# Altium schematic sheet kardio.SchDoc
size A3
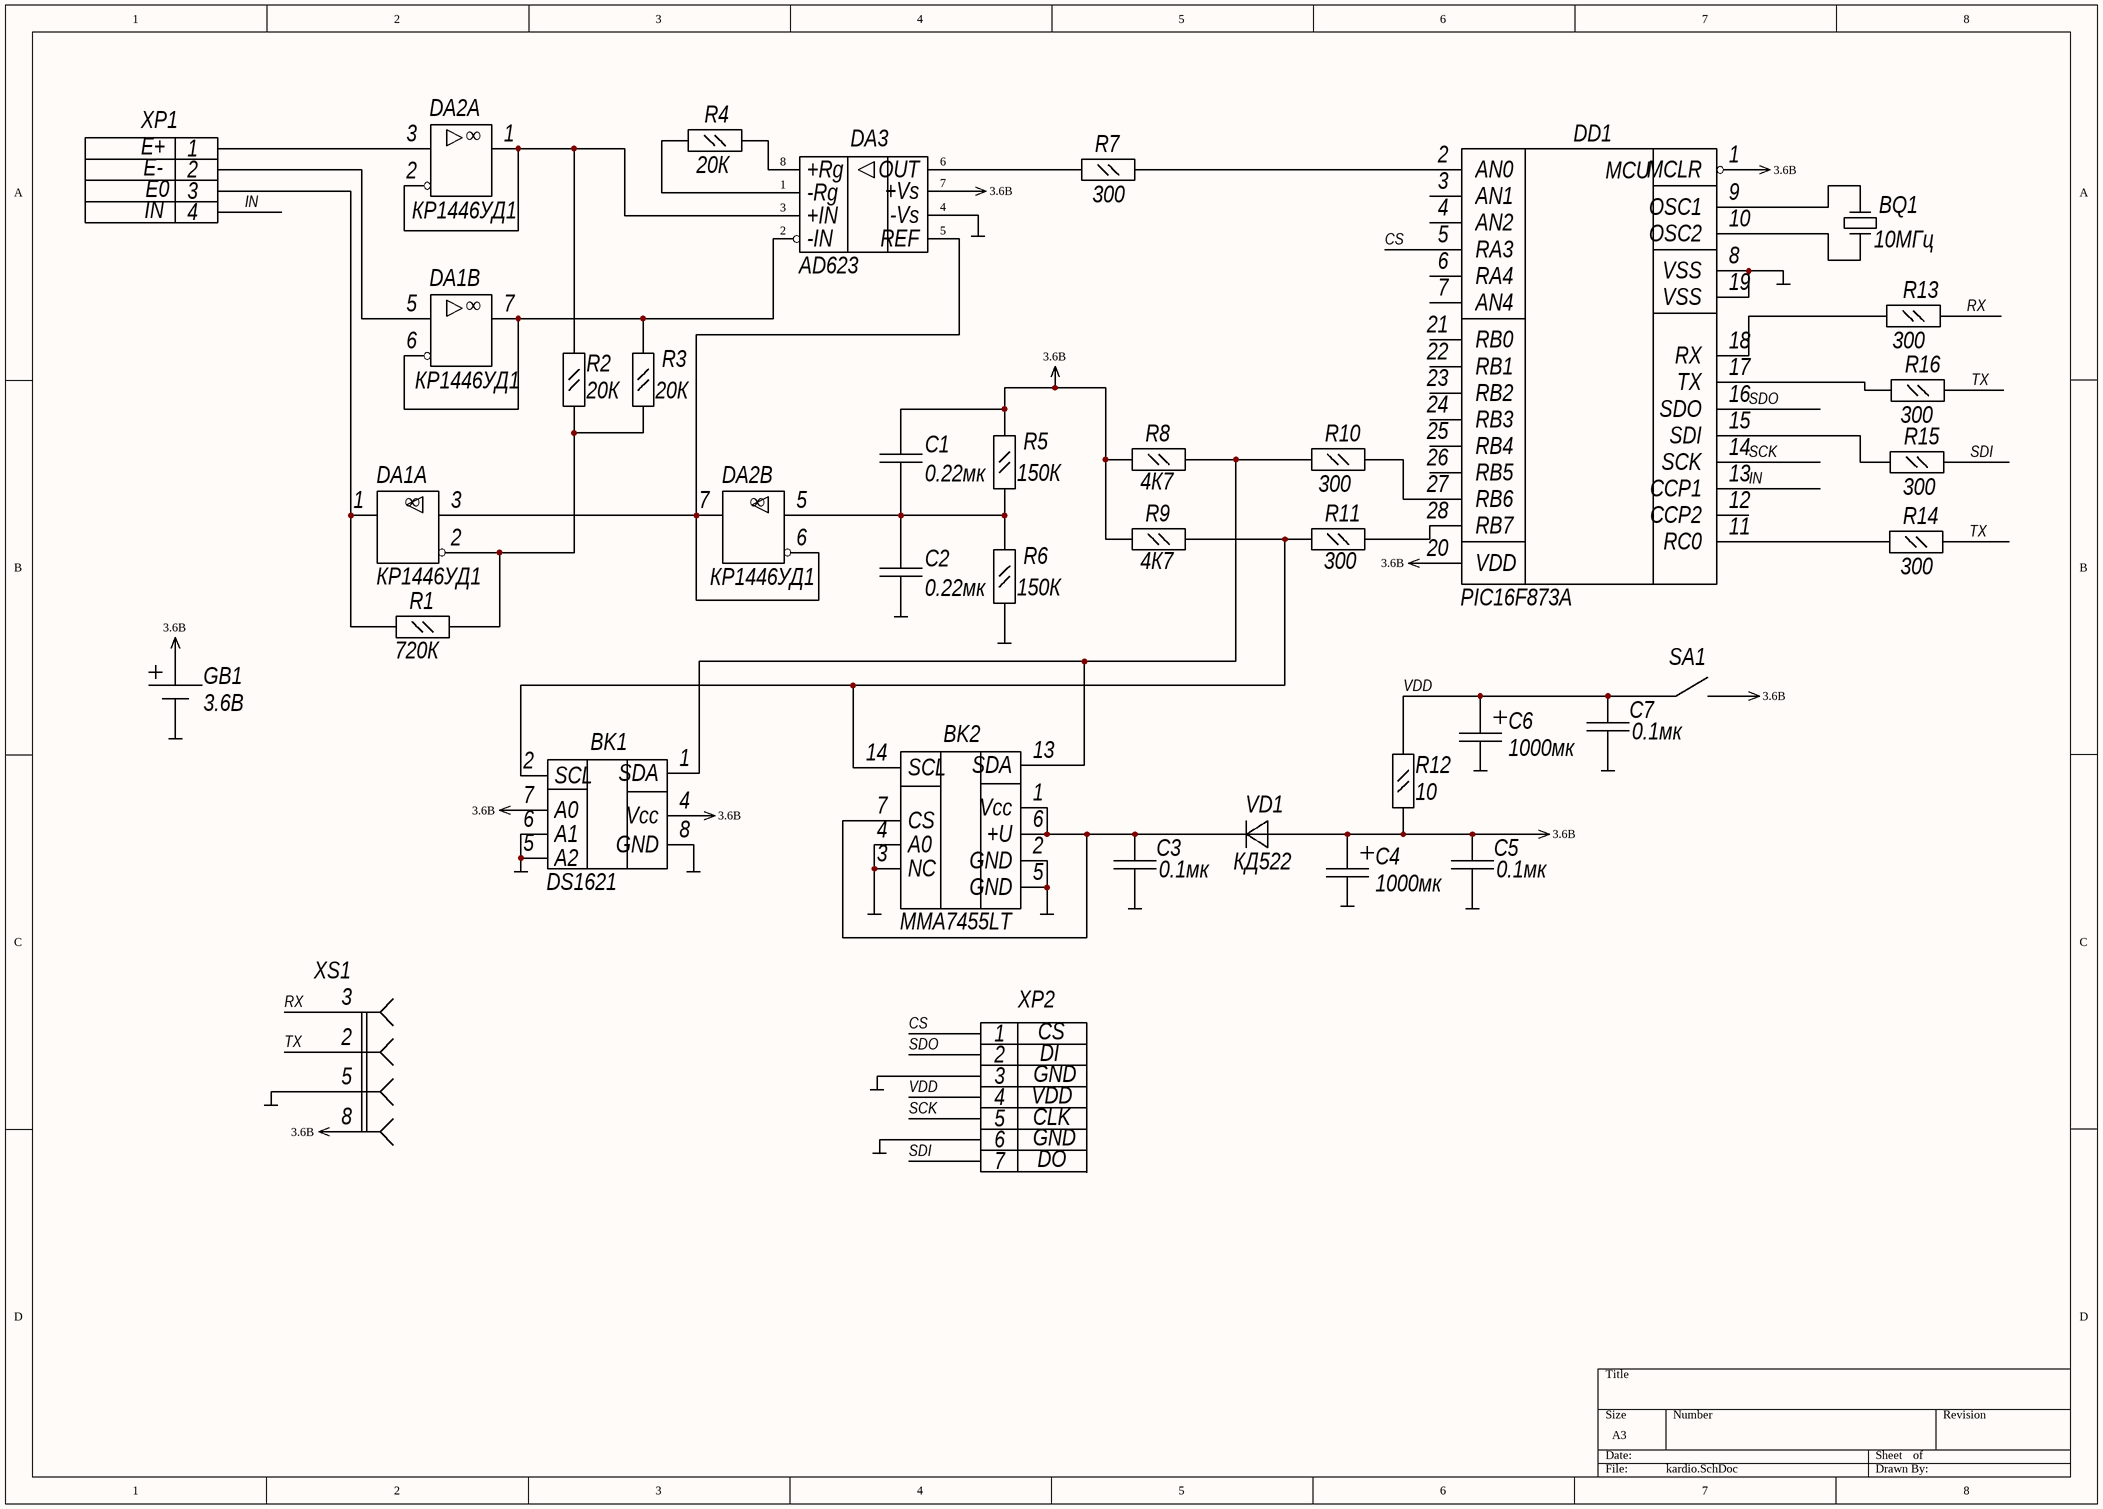
[diagram p0: kardio.SchDoc]

## Parts
BK1  DS1621  [SOIC-8CM]
BK2  MMA7455LT  [SOJ80P300X0-12M]
BQ1  10МГц  [HC49S]
C1  0.22мк  [C0805]
C2  0.22мк  [C0805]
C3  0.1мк  [C0805]
C4  1000мк  [LZ 12x26 1000 мкФ x 25 В]
C5  0.1мк  [C0805]
C6  1000мк  [LZ 12x26 1000 мкФ x 25 В]
C7  0.1мк  [C0805]
DA1  КР1446УД1  [PDIP8]  (parts A,B of 2)
DA2  КР1446УД1  [PDIP8]  (parts A,B of 2)
DA3  AD623  [SOIC-8CM]
DD1  PIC16F873A  [SOIC-SO28_M]
GB1  3.6B  [Button]
R1  720К  [1206]
R2  20К  [1206]
R3  20К  [1206]
R4  20К  [1206]
R5  150К  [1206]
R6  150К  [1206]
R7  300  [1206]
R8  4К7  [1206]
R9  4К7  [1206]
R10  300  [1206]
R11  300  [1206]
R12  10  [1206]
R13  300  [1206]
R14  300  [1206]
R15  300  [1206]
R16  300  [1206]
SA1  Button  [Button]  (value not drawn)
VD1  КД522  [DO-41]
XP1  INPUT  [HDR1X4 - WA]  (value not drawn)
XP2  SD-card  [HDR2X4 - wide area]  (value not drawn)
XS1  COM-port  (value not drawn)

## Nets
3.6В: BK1.4(Vcc) BK1.7(A0) C1.2 C4.1 C5.1 DA3.7(+Vs) DD1.1(MCLR) DD1.20(VDD) GB1.2 R5.2 R8.1 R9.1 R12.1 SA1.2 VD1.1 XS1.8
GND: BK1.5(A2) BK1.6(A1) BK1.8(GND) BK2.2(GND) BK2.3(NC) BK2.4(A0) BK2.5(GND) C2.1 C3.2 C4.2 C5.2 C6.2 C7.2 DA3.4(-Vs) DD1.8(VSS) DD1.19(VSS) GB1.1 R6.1 XP2.3 XP2.6 XS1.5
CS: DD1.5(RA3) XP2.1
IN: DD1.13(CCP1) XP1.4
RX: R13.2 XS1.3
SCK: DD1.14(SCK) XP2.5
SDI: R15.2 XP2.7
SDO: DD1.16(SDO) XP2.2
TX: R14.2 R16.2 XS1.2
VDD: C6.1 C7.1 R12.2 SA1.1 XP2.4
NetBK1_1: BK1.1(SDA) BK2.13(SDA) R8.2 R10.1
NetBK1_2: BK1.2(SCL) BK2.14(SCL) R9.2 R11.1
NetBK2_1: BK2.1(Vcc) BK2.6(+U) BK2.7(CS) C3.1 VD1.2
NetBQ1_1: BQ1.1 DD1.10(OSC2)
NetBQ1_2: BQ1.2 DD1.9(OSC1)
NetC1_1: C1.1 C2.2 DA2.5 R5.1 R6.2
NetDA1_1: DA1.1 R1.1 XP1.3
NetDA1_2: DA1.2 R1.2 R2.1 R3.1
NetDA1_3: DA1.3 DA2.6 DA2.7 DA3.5(REF)
NetDA1_5: DA1.5 XP1.2
NetDA1_6: DA1.6 DA1.7 DA3.2(-IN) R3.2
NetDA2_1: DA2.1 DA2.2 DA3.3(+IN) R2.2
NetDA2_3: DA2.3 XP1.1
NetDA3_1: DA3.1(-Rg) R4.2
NetDA3_6: DA3.6(OUT) R7.1
NetDA3_8: DA3.8(+Rg) R4.1
NetDD1_2: DD1.2(AN0) R7.2
NetDD1_11: DD1.11(RC0) R14.1
NetDD1_15: DD1.15(SDI) R15.1
NetDD1_17: DD1.17(TX) R16.1
NetDD1_18: DD1.18(RX) R13.1
NetDD1_27: DD1.27(RB6) R10.2
NetDD1_28: DD1.28(RB7) R11.2

Not connected (* = marked no-connect by the designer): DD1 3(AN1) 4(AN2) 6(RA4) 7(AN4) 12(CCP2) 21(RB0) 22(RB1) 23(RB2) 24(RB3) 25(RB4) 26(RB5)

## Notes on the sheet
- (in symbol INPUT) E+; E-; E0; IN
- (in symbol PIC16F873A-I/SO) MCU
- (in symbol SD-card) CS; DI; GND; VDD; CLK; DO
- (in symbol КР1446УД1, part A) ∞
- (in symbol КР1446УД1, part B) ∞

## Library data of the parts
BK1 = DS1621: Temperature sensor
BK2 = MMA7455LT: Digital Output Accelerometer
BQ1 = Cristal Oscilator
C1-C3 C5 C7 = Capasitior
C4 C6 = Capasitor electrolit
DA3 = AD623: Amplifier
DD1 = PIC16F873A-I/SO: Enhanced FLASH Microcontroller, 4K (x14-Bit words) FLASH, 192 Bytes RAM, 28-Pin SOIC, Standard VDD Range, Industrial Temperature; ComponentAvailability: Unknown. Contact manufacturer to determine status.; Published: 11-Oct-2004; LatestRevisionDate: 29-Jan-2009; LatestRevisionNote: Sch. layout revised. 3D Model Removed.; DatasheetVersion: revB, Oct-2003; PackageVersion: revBB, Aug-2009; PackageReference: SOIC-SO28; Publisher: Altium Limited; PackageDescription: 28-Lead Plastic Small Outline (SO) - Wide 7.50mm Body [SOIC]; Supplier 1: Digi-Key; Supplier Part Number 1: PIC16F873A-I/SO-ND; Supplier 2: Farnell; Supplier Part Number 2: 1660034; Supplier 3: Farnell; Supplier Part Number 3: 9761080; Code_JEDEC: MS-013; ComponentLink1Description: Datasheet; ComponentLink1URL: http://ww1.microchip.com/downloads/en/DeviceDoc/39582b.pdf; ComponentLink2Description: Packaging Specification; ComponentLink2URL: http://www.microchip.com/stellent/groups/techpub_sg/documents/packagingspec/en012702.pdf; ComponentLink3Description: Microchip.com Home; ComponentLink3URL: http://www.microchip.com/
GB1 = Batery
R1-R16 = Resistor